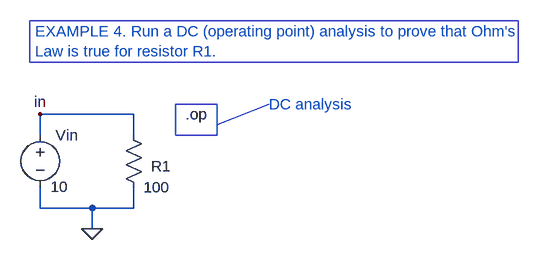
[diagram p0: schematic example-004.asc]
example-004.asc, the LTspice schematic file:
Version 4
SHEET 1 880 680
WIRE 256 80 112 80
WIRE 112 112 112 80
WIRE 256 112 256 80
WIRE 112 224 112 192
WIRE 192 224 112 224
WIRE 256 224 256 192
WIRE 256 224 192 224
WIRE 192 256 192 224
FLAG 192 256 0
FLAG 112 80 in
SYMBOL res 240 96 R0
WINDOW 3 31 96 Left 2
WINDOW 0 43 64 Left 2
SYMATTR Value 100
SYMATTR InstName R1
SYMBOL voltage 112 96 R0
WINDOW 123 0 0 Left 2
WINDOW 39 0 0 Left 2
WINDOW 3 16 95 Left 2
SYMATTR Value 10
SYMATTR InstName Vin
TEXT 104 -48 Left 2 ;EXAMPLE 4. Run a DC (operating point) analysis to prove that Ohm's \nLaw is true for resistor R1.
TEXT 336 80 Left 2 !.op
TEXT 464 64 Left 2 ;DC analysis
LINE Normal 384 96 464 64
RECTANGLE Normal 96 -64 848 0
RECTANGLE Normal 320 64 384 112

The netlist it stands for:
* example-004.asc
R1 in 0 100
Vin in 0 10
* EXAMPLE 4. Run a DC (operating point) analysis to prove that Ohm's
* Law is true for resistor R1.
.op
* DC analysis
.backanno
.end